# Altium schematic sheet схема 1.SchDoc
size A4; SheetNumber: 1; SheetTotal: 1
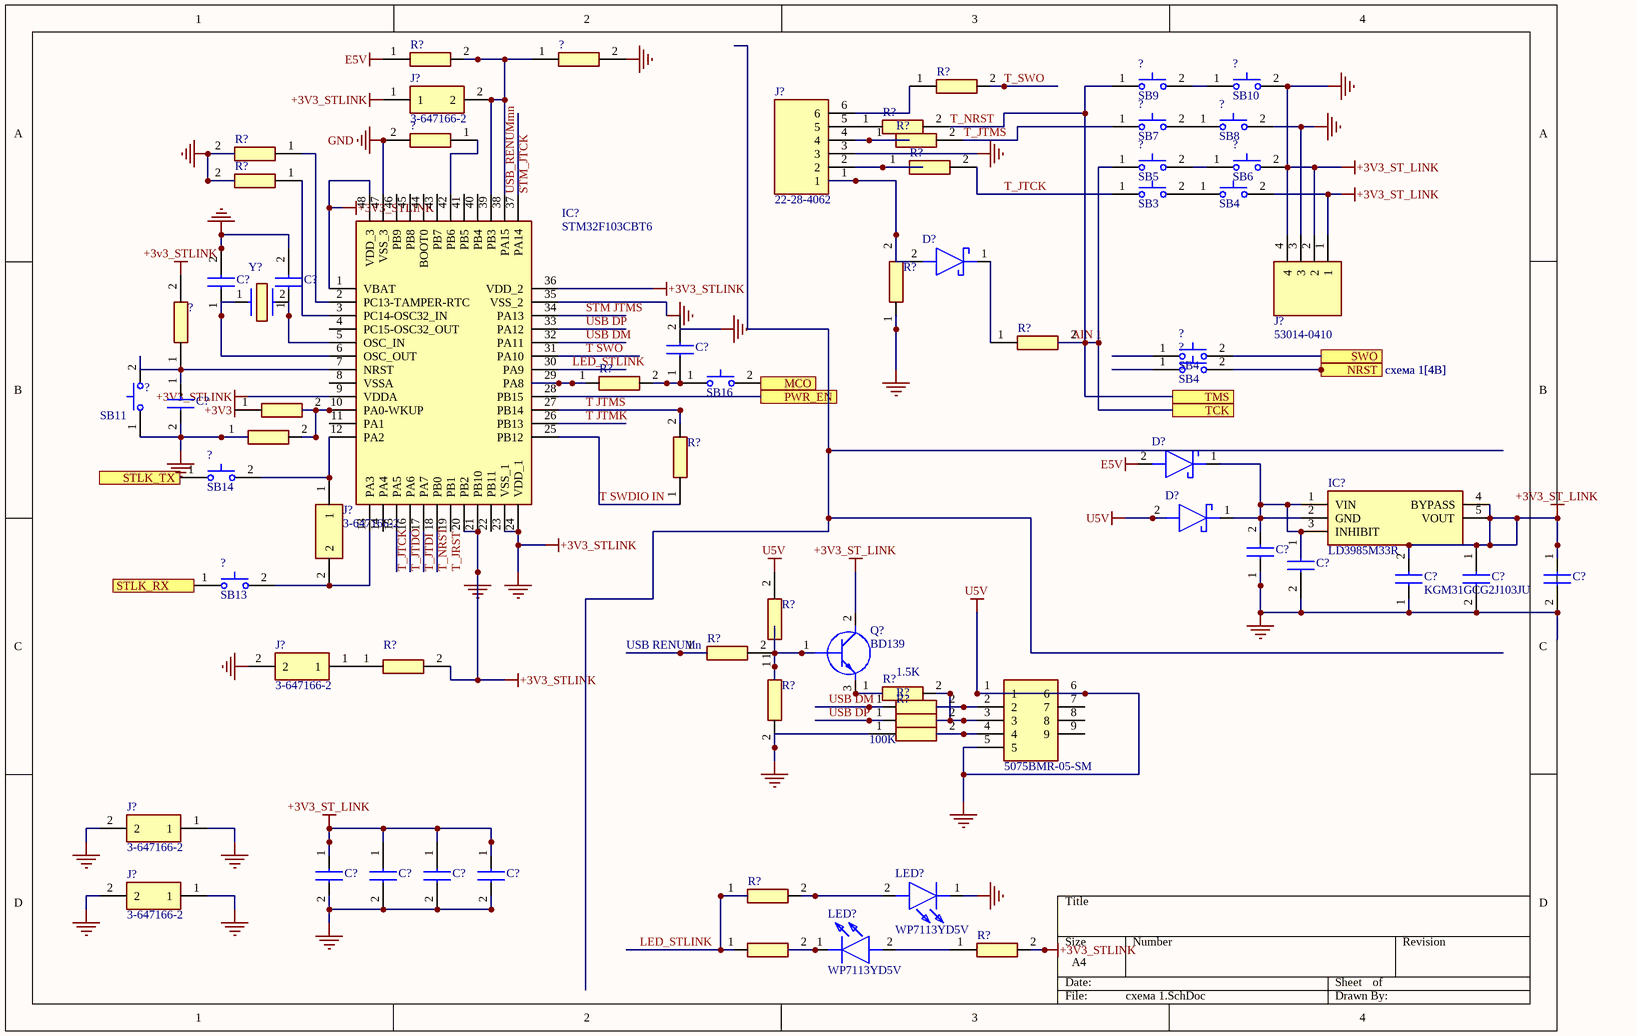
[diagram p0: схема 1.SchDoc]

## Parts
(Parts that share a designator on the sheet are numbered #1, #2 ... from top to bottom, then left to right.)
?#1  (no value)  [RESC1005X37N]
?#2  SB9  [8631CQD2]
?#3  SB10  [8631CQD2]
?#4  SB7  [8631CQD2]
?#5  SB8  [8631CQD2]
?#6  (no value)  [RESC1005X40N]
?#7  SB5  [8631CQD2]
?#8  SB6  [8631CQD2]
?#9  SB3  [8631CQD2]
?#10  SB4  [8631CQD2]
?#11  SB4  [8631CQD2]
?#12  (no value)  [RESC1005X40N]
?#13  SB4  [8631CQD2]
?#14  SB16  [8631CQD2]
?#15  (no value)  [RESC1005X37N]
?#16  SB11  [8631CQD2]
?#17  (no value)  [RESC1005X37N]
?#18  SB14  [8631CQD2]
?#19  SB13  [8631CQD2]
?#20  5075BMR-05-SM  [5075BMR05SM]
?#21  (no value)  [RESC1005X40N]
?#22  (no value)  [RESC1005X37N]
C?#1  (no value)  [C1206]
C?#2  (no value)  [C1206]
C?#3  (no value)  [CAPC1608X90N]
C?#4  (no value)  [C1206]
C?#5  (no value)  [CAPC1608X90N]
C?#6  (no value)  [CAPC1608X90N]
C?#7  (no value)  [CAPC1608X90N]
C?#8  (no value)  [MAJx16]
C?#9  KGM31GCG2J103JU  [CAPC3316X145N]
C?#10  (no value)  [CAPC1608X90N]
C?#11  (no value)  [CAPC1608X90N]
C?#12  (no value)  [CAPC1608X90N]
C?#13  (no value)  [CAPC1608X90N]
D?#1  (no value)  [SOD2513X117N]
D?#2  (no value)  [SOD2513X117N]
D?#3  (no value)  [SOD2513X117N]
IC?#1  STM32F103CBT6  [QFP50P900X900X160-48N]
IC?#2  LD3985M33R  [SOT95P280X145-5N]
J?#1  3-647166-2  [36471662]
J?#2  22-28-4062  [HDRV6W66P0X254_1X6_1524X249X838P]
J?#3  53014-0410  [SHDR4W60P0X200_1X4_1200X435X1000P]
J?#4  3-647166-2  [36471662]
J?#5  3-647166-2  [36471662]
J?#6  3-647166-2  [36471662]
J?#7  3-647166-2  [36471662]
LED?#1  WP7113YD5V  [WP7113YD5V]
LED?#2  WP7113YD5V  [WP7113YD5V]
Q?  BD139  [TO254P290X760X1320-3P]
R?#1  (no value)  [RESC3225X70N]
R?#2  (no value)  [ERA6AEB1020V]
R?#3  (no value)  [ERA6AEB1020V]
R?#4  (no value)  [ERA6AEB1020V]
R?#5  (no value)  [RESC3216X74N]
R?#6  (no value)  [ERA6AEB1020V]
R?#7  (no value)  [RESC3216X74N]
R?#8  (no value)  [RESC3216X74N]
R?#9  (no value)  [RESC1005X37N]
R?#10  (no value)  [RESC1005X37N]
R?#11  (no value)  [RESC1005X37N]
R?#12  (no value)  [RESC1005X37N]
R?#13  (no value)  [RESC2012X55N]
R?#14  (no value)  [ERA6AEB1020V]
R?#15  (no value)  [RESC3216X74N]
R?#16  1.5K  [RESC3116X65N]
R?#17  (no value)  [RESC2013X84N]
R?#18  100K  [RESC1005X40N]
R?#19  (no value)  [RESC1005X37N]
R?#20  (no value)  [RESC2013X84N]
Y?  (no value)  [ECS80125PXGMTR]

## Ports
MCO, NRST (see схема 1[4B]), PWR_EN, STLK_RX, STLK_TX, SWO, TCK, TMS

## Nets
+3V3_ST_LINK: ?#1.2 ?#3.2(N.O._2) ?#5.2(N.O._2) ?#8.2(N.O._2) ?#10.2(N.O._2) ?#12.2 ?#16.1(N.O._1) ?#17.1 ?#20.1 ?#20.5 ?#20.6 ?#21.1 C?#1.2 C?#2.2 C?#3.2 C?#5.2 C?#6.1 C?#6.2 C?#7.1 C?#7.2 C?#8.1 C?#9.1 C?#9.2 C?#10.1 C?#10.2 C?#11.1 C?#11.2 C?#12.1 C?#12.2 C?#13.1 C?#13.2 D?#3.2(A) IC?#1.1(VBAT) IC?#1.9(VDDA) IC?#1.20(PB2) IC?#1.21(PB10) IC?#1.23(VSS_1) IC?#1.24(VDD_1) IC?#1.35(VSS_2) IC?#1.36(VDD_2) IC?#1.48(VDD_3) IC?#2.4(BYPASS) IC?#2.5(VOUT) J?#1.1 J?#2.3 J?#3.1 J?#3.2 J?#3.3 J?#3.4 J?#5.2 J?#6.1 J?#6.2 J?#7.1 J?#7.2 LED?#1.1(K) Q?.2(C) R?#5.2 R?#7.2 R?#8.1 R?#13.2 R?#14.2 R?#15.2 R?#20.2  [also labelled +3V3_STLINK, U5V]
E5V: D?#2.2(A) R?#1.1
GND: ?#6.2 IC?#1.47(VSS_3)
MCO: ?#14.2(N.O._2) ; port MCO
NRST: ?#13.2(N.O._2) ; port NRST
PWR_EN: IC?#1.28(PB15) ; port PWR_EN
STLK_TX: ?#18.1(N.O._1) ; port STLK_TX
SWO: ?#11.2(N.O._2) ; port SWO
TCK: ?#2.1(N.O._1) ?#7.1(N.O._1) R?#3.2 R?#9.2 ; port TCK, port TMS
Net?#1_1: ?#1.1 IC?#1.38(PA15) IC?#1.39(PB3) J?#1.2 R?#1.2
Net?#2_2: ?#2.2(N.O._2) ?#3.1(N.O._1)
Net?#4_1: ?#4.1(N.O._1) R?#4.2
Net?#4_2: ?#4.2(N.O._2) ?#5.1(N.O._1)
Net?#6_1: ?#6.1 IC?#1.42(PB6)
Net?#7_2: ?#7.2(N.O._2) ?#8.1(N.O._1)
Net?#9_1: ?#9.1(N.O._1) R?#6.2
Net?#9_2: ?#9.2(N.O._2) ?#10.1(N.O._1)
Net?#12_1: ?#12.1 ?#16.2(N.O._2) C?#3.1 IC?#1.7(NRST)
Net?#14_1: ?#14.1(N.O._1) C?#4.1 R?#10.2
Net?#15_2: ?#15.2 ?#17.2 IC?#1.10(PA0-WKUP)
Net?#18_2: ?#18.2(N.O._2) IC?#1.12(PA2) J?#4.1
Net?#19_2: ?#19.2(N.O._2) IC?#1.13(PA3) J?#4.2
Net?#20_2: ?#20.2 R?#17.2
Net?#20_3: ?#20.3 R?#16.2 R?#18.2
Net?#20_4: ?#20.4 ?#21.2
Net?#22_1: ?#22.1 R?#19.1
Net?#22_2: ?#22.2 LED?#2.1(K)
NetC?#1_1: C?#1.1 IC?#1.6(OSC_OUT) Y?.1
NetC?#2_1: C?#2.1 IC?#1.5(OSC_IN) Y?.2
NetC?#5_1: C?#5.1 C?#8.2 D?#2.1(K) D?#3.1(K) IC?#2.1(VIN) IC?#2.2(GND) IC?#2.3(INHIBIT)
NetD?#1_1: D?#1.1(K) R?#9.1
NetD?#1_2: D?#1.2(A) J?#2.1 R?#8.2
NetIC?#1_2: IC?#1.2(PC13-TAMPER-RTC) R?#5.1
NetIC?#1_3: IC?#1.3(PC14-OSC32_IN) R?#7.1
NetIC?#1_25: IC?#1.25(PB12) R?#11.1
NetIC?#1_27: IC?#1.27(PB14) R?#11.2
NetIC?#1_29: IC?#1.29(PA8) R?#10.1
NetJ?#2_2: J?#2.2 R?#6.1
NetJ?#2_4: J?#2.4 R?#4.1
NetJ?#2_5: J?#2.5 R?#3.1
NetJ?#2_6: J?#2.6 R?#2.1
NetJ?#5_1: J?#5.1 R?#14.1
NetLED?#1_2: LED?#1.2(A) R?#19.2
NetLED?#2_2: LED?#2.2(A) R?#20.1
NetQ?_1: Q?.1(B) R?#12.2 R?#13.1 R?#15.1
NetQ?_3: Q?.3(E) R?#16.1

Not connected (* = marked no-connect by the designer): ?#11 1(N.O._1); ?#13 1(N.O._1); ?#15 1; ?#19 1(N.O._1); ?#20 7 8 9; C?#4 2; IC?#1 4(PC15-OSC32_OUT) 8(VSSA) 11(PA1) 14(PA4) 15(PA5) 16(PA6) 17(PA7) 18(PB0) 19(PB1) 22(PB11) 26(PB13) 30(PA9) 31(PA10) 32(PA11) 33(PA12) 34(PA13) 37(PA14) 40(PB4) 41(PB5) 43(PB7) 44(BOOT0) 45(PB8) 46(PB9); R?#2 2; R?#12 1; R?#17 1; R?#18 1

## Notes on the sheet
- (near R?#2) T_SWO
- (near R?#4) T_NRST
- (near R?#4) T_JTMS
- (near IC?#1) USB_RENUMmn
- (near IC?#1) STM_JTCK
- T_JTCK
- STM JTMS
- (near R?#10) LED_STLINK
- USB DP
- USB DM
- (near R?#10) T SWO
- (near R?#9) AIN 1
- (near R?#10) T JTMS
- (near R?#10) T JTMK
- (near R?#11) T SWDIO IN
- (near IC?#1) T_JTCK
- (near IC?#1) T_JTDO
- (near IC?#1) T_JTDI
- (near IC?#1) T_NRST
- (near IC?#1) T_JRST
- (near R?#12) USB RENUMn
- LED_STLINK
- Labels drawn without touching a wire or pin: +3V3

## Library data of the parts
?#1 ?#15 ?#17 = MCS04020D4701BE000: Resistor; Manufacturer_Name: Vishay; Datasheet Link: http://www.vishay.com/docs/28705/mcx0x0xpro.pdf; Height: 0.37mm; Manufacturer_Part_Number: MCS04020D4701BE000; Mouser Part Number: 594-MCS04020D4701BE0; Mouser Price/Stock: https://www.mouser.co.uk/ProductDetail/Vishay-Beyschlag/MCS04020D4701BE000?qs=ft9OtscSA3%252BR0DpF5QqL2Q%3D%3D
?#2-?#5 ?#7-?#11 ?#13 ?#14 ?#16 ?#18 ?#19 = 8631CQD2: Switch (2-Pin Push); Manufacturer_Name: C & K COMPONENTS; Datasheet Link: https://www.ckswitches.com/media/1396/8600.pdf; Height: 13.93mm; Manufacturer_Part_Number: 8631CQD2; Mouser Part Number: 611-8631-261; Mouser Price/Stock: https://www.mouser.co.uk/ProductDetail/CK/8631CQD2?qs=ktcBc77oICXe9iPhfEwnkA%3D%3D
?#6 ?#12 ?#21 R?#18 = SFR01MZPF1003: Resistor; Manufacturer_Name: ROHM Semiconductor; Datasheet Link: https://fscdn.rohm.com/en/products/databook/datasheet/passive/resistor/chip_resistor/sfr-e.pdf; Height: 0.4mm; Manufacturer_Part_Number: SFR01MZPF1003; Mouser Part Number: 755-SFR01MZPF1003; Mouser Price/Stock: https://www.mouser.co.uk/ProductDetail/ROHM-Semiconductor/SFR01MZPF1003?qs=Mv7BduZupUj2RFL5gMaKTg%3D%3D
?#20 = 5075BMR-05-SM: Connector; Manufacturer_Name: NELTRON; Datasheet Link: http://www.ibselectronics.com/ibsstore/datasheet/5075BMR-05-SM-CR.pdf; Height: 4mm; Manufacturer_Part_Number: 5075BMR-05-SM
?#22 R?#9-R?#12 R?#19 = MCS04020C1000FE000: Resistor; Manufacturer_Name: Vishay; Datasheet Link: http://www.vishay.com/docs/28705/mcx0x0xpro.pdf; Height: 0.37mm; Manufacturer_Part_Number: MCS04020C1000FE000; Mouser Part Number: 594-MCS04020C1000FE0; Mouser Price/Stock: https://www.mouser.co.uk/ProductDetail/Vishay-Beyschlag/MCS04020C1000FE000?qs=7ZE6F4QMOBYkwvQlfbkT8w%3D%3D; Arrow Part Number: MCS04020C1000FE000; Arrow Price/Stock: https://www.arrow.com/en/products/mcs04020c1000fe000/vishay
C?#1 C?#2 C?#4 = C1206C200KCGACTU: Capacitor; Manufacturer_Name: KEMET; Datasheet Link: https://content.kemet.com/datasheets/KEM_C1009_C0G_HV_SMD.pdf; Manufacturer_Part_Number: C1206C200KCGACTU
C?#3 C?#5-C?#7 C?#10-C?#13 = KAM15AR71H104KM: Capacitor; Manufacturer_Name: Kyocera AVX; Datasheet Link: https://datasheets.kyocera-avx.com/AutoMLCCKAM.pdf; Height: 0.9mm; Manufacturer_Part_Number: KAM15AR71H104KM; Mouser Part Number: 581-KAM15AR71H104KM; Mouser Price/Stock: https://www.mouser.co.uk/ProductDetail/KYOCERA-AVX/KAM15AR71H104KM?qs=Jm2GQyTW%2FbgzS5FHJWrFzQ%3D%3D; Arrow Part Number: KAM15AR71H104KM; Arrow Price/Stock: https://www.arrow.com/en/products/kam15ar71h104km/avx?region=nac
C?#8 = MAJCT168BB7105KTEA01: Capacitor; Manufacturer_Name: TAIYO YUDEN; Datasheet Link: https://ds.yuden.co.jp/TYCOMPAS/or/detail?pn=MAJCT168BB7105KTEA01; Height: 0.8mm; Manufacturer_Part_Number: MAJCT168BB7105KTEA01
C?#9 = KGM31GCG2J103JU: Capacitor; Manufacturer_Name: Kyocera AVX; Datasheet Link: https://datasheets.kyocera-avx.com/HVKGM.pdf; Height: 1.45mm; Manufacturer_Part_Number: KGM31GCG2J103JU; Mouser Part Number: 581-KGM31GCG2J103JU; Mouser Price/Stock: https://www.mouser.co.uk/ProductDetail/KYOCERA-AVX/KGM31GCG2J103JU?qs=63Lh8XYXgjt6ivbLeGkCxg%3D%3D
D?#1-D?#3 = BAT60JFILM: Schottky Diode; Manufacturer_Name: STMicroelectronics; Datasheet Link: https://www.mouser.jp/datasheet/2/389/cd00001944-1795661.pdf; Height: 1.17mm; Manufacturer_Part_Number: BAT60JFILM; Mouser Part Number: 511-BAT60JFILM; Mouser Price/Stock: https://www.mouser.co.uk/ProductDetail/STMicroelectronics/BAT60JFILM?qs=GnFZssByvVVVnMaukcyLZg%3D%3D; Arrow Part Number: BAT60JFILM; Arrow Price/Stock: https://www.arrow.com/en/products/bat60jfilm/stmicroelectronics?region=nac
IC?#1 = STM32F103CBT6: Integrated Circuit; Manufacturer_Name: STMicroelectronics; Datasheet Link: http://www.st.com/st-web-ui/static/active/en/resource/technical/document/datasheet/CD00161566.pdf; Height: 1.6mm; Manufacturer_Part_Number: STM32F103CBT6; Mouser Part Number: 511-STM32F103CBT6; Mouser Price/Stock: https://www.mouser.co.uk/ProductDetail/STMicroelectronics/STM32F103CBT6?qs=WxFF5lh7QM3goh6GV5Ogig%3D%3D; Arrow Part Number: STM32F103CBT6; Arrow Price/Stock: https://www.arrow.com/en/products/stm32f103cbt6/stmicroelectronics?region=europe
IC?#2 = LD3985M33R: Integrated Circuit; Manufacturer_Name: STMicroelectronics; Datasheet Link: http://www.st.com/st-web-ui/static/active/en/resource/technical/document/datasheet/CD00003395.pdf; Height: 1.45mm; Manufacturer_Part_Number: LD3985M33R; Mouser Part Number: 511-LD3985M33R; Mouser Price/Stock: https://www.mouser.co.uk/ProductDetail/STMicroelectronics/LD3985M33R?qs=22WmWNTp1rrPOccVv4HZ7A%3D%3D; Arrow Part Number: LD3985M33R; Arrow Price/Stock: https://www.arrow.com/en/products/ld3985m33r/stmicroelectronics?region=europe
J?#1 J?#4-J?#7 = 3-647166-2: Connector; Manufacturer_Name: TE Connectivity; Datasheet Link: https://www.te.com/commerce/DocumentDelivery/DDEController?Action=showdoc&DocId=Customer+Drawing%7F647166%7FR1%7Fpdf%7FEnglish%7FENG_CD_647166_R1.pdf%7F3-647166-2; Height: 10.66mm; Manufacturer_Part_Number: 3-647166-2; Mouser Part Number: 571-3-647166-2; Mouser Price/Stock: https://www.mouser.co.uk/ProductDetail/TE-Connectivity/3-647166-2?qs=xsTFCgGnzbJU1qz6Np9kzA%3D%3D; Arrow Part Number: 3-647166-2; Arrow Price/Stock: https://www.arrow.com/en/products/3-647166-2/te-connectivity?region=nac
J?#2 = 22-28-4062: Connector; Manufacturer_Name: Molex; Datasheet Link: https://datasheet.datasheetarchive.com/originals/distributors/SFDatasheet-1/sf-00031037.pdf; Height: 8.38mm; Manufacturer_Part_Number: 22-28-4062; Mouser Part Number: 538-22-28-4062; Mouser Price/Stock: https://www.mouser.com/Search/Refine.aspx?Keyword=538-22-28-4062
J?#3 = 53014-0410: Connector; Manufacturer_Name: Molex; Datasheet Link: https://www.molex.com/pdm_docs/sd/530140410_sd.pdf; Height: 10mm; Manufacturer_Part_Number: 53014-0410; Mouser Part Number: 538-53014-0410; Mouser Price/Stock: https://www.mouser.co.uk/ProductDetail/Molex/53014-0410?qs=TLs3Kb%252BkMqKk8s1WRHwRGw%3D%3D
LED?#1 LED?#2 = WP7113YD5V: LED; Manufacturer_Name: Kingbright; Datasheet Link: https://www.kingbrightusa.com/images/catalog/SPEC/WP7113YD5V.pdf; Height: 8.85mm; Manufacturer_Part_Number: WP7113YD5V; Mouser Part Number: 604-WP7113YD5V; Mouser Price/Stock: https://www.mouser.co.uk/ProductDetail/Kingbright/WP7113YD5V/?qs=58z0TXQGVSQxAnYThDK13Q%3D%3D; Arrow Part Number: WP7113YD5V; Arrow Price/Stock: https://www.arrow.com/en/products/wp7113yd5v/kingbright
Q? = BD139: Transistor BJT NPN; Manufacturer_Name: STMicroelectronics; Datasheet Link: http://www.st.com/web/en/resource/technical/document/datasheet/CD00001225.pdf; Height: 2.9mm; Manufacturer_Part_Number: BD139; Mouser Part Number: 511-BD139; Mouser Price/Stock: https://www.mouser.co.uk/ProductDetail/STMicroelectronics/BD139?qs=ljbEvF4DwOPW%2FLxHSWYMMA%3D%3D; Arrow Part Number: BD139; Arrow Price/Stock: https://www.arrow.com/en/products/bd139/stmicroelectronics?region=europe
R?#1 = CRCW12102K70FKEAHP: Resistor; Manufacturer_Name: Vishay; Datasheet Link: http://componentsearchengine.com/Datasheets/1/CRCW12102K70FKEAHP.pdf; Height: 0.7mm; Manufacturer_Part_Number: CRCW12102K70FKEAHP; Mouser Part Number: 71-CRCW12102K70FKEAH; Mouser Price/Stock: https://www.mouser.co.uk/ProductDetail/Vishay-Dale/CRCW12102K70FKEAHP?qs=OAzHGkhREL0m0%252BU1n6AaAg%3D%3D
R?#2-R?#4 R?#6 R?#14 = ERA-6AHD220V: Resistor; Manufacturer_Name: Panasonic; Datasheet Link: https://industrial.panasonic.com/cdbs/www-data/pdf/RDM0000/AOA0000C307.pdf; Height: 0.6mm; Manufacturer_Part_Number: ERA-6AHD220V; Mouser Part Number: 667-ERA-6AHD220V; Mouser Price/Stock: https://www.mouser.co.uk/ProductDetail/Panasonic/ERA-6AHD220V/?qs=MNPzkKEzRtQTWqg2JSKn2A%3D%3D
R?#5 R?#7 R?#8 R?#15 = CRMV1206AF10K0FKE5: Resistor; Manufacturer_Name: Vishay; Datasheet Link: https://www.vishay.com/docs/68037/crmv.pdf; Height: 0.74mm; Manufacturer_Part_Number: CRMV1206AF10K0FKE5; Mouser Part Number: 71-RMV1206AF10K0FKE5; Mouser Price/Stock: https://www.mouser.co.uk/ProductDetail/Vishay-Techno/CRMV1206AF10K0FKE5?qs=l8RvIzyJx4lLA%2F4RSSc%2F9A%3D%3D
R?#13 = TNPW080536K0BEEA: Resistor; Manufacturer_Name: Vishay; Datasheet Link: https://www.vishay.com/docs/31006/tnpw.pdf; Height: 0.55mm; Manufacturer_Part_Number: TNPW080536K0BEEA
R?#16 = CRCW12061K50FKEAHP: Resistor; Manufacturer_Name: Vishay; Datasheet Link: http://componentsearchengine.com/Datasheets/1/CRCW12061K50FKEAHP.pdf; Height: 0.65mm; Manufacturer_Part_Number: CRCW12061K50FKEAHP; Mouser Part Number: 71-CRCW12061K50FKEAH; Mouser Price/Stock: https://www.mouser.co.uk/ProductDetail/Vishay-Dale/CRCW12061K50FKEAHP?qs=k2%2FDWSARqgEwHXAQbL4aEg%3D%3D; Arrow Part Number: CRCW12061K50FKEAHP; Arrow Price/Stock: https://www.arrow.com/en/products/crcw12061k50fkeahp/vishay?region=nac
R?#17 R?#20 = WSL080500000ZEA9: Resistor; Manufacturer_Name: Vishay; Datasheet Link: https://ad.componentsearchengine.com/Datasheets/2/WSL080500000ZEA9.pdf; Height: 0.838mm; Manufacturer_Part_Number: WSL080500000ZEA9; Mouser Part Number: 71-WSL080500000ZEA9; Mouser Price/Stock: https://www.mouser.co.uk/ProductDetail/Vishay-Dale/WSL080500000ZEA9?qs=f1l5vAGoKgsImKS87N8TmQ%3D%3D; Arrow Part Number: WSL080500000ZEA9; Arrow Price/Stock: https://www.arrow.com/en/products/wsl080500000zea9/vishay?region=nac
Y? = ECS-80-12-5PX-GM-TR: Crystal or Oscillator; Manufacturer_Name: ECS; Datasheet Link: https://ecsxtal.com/store/pdf/csm-7x.pdf; Height: 4.3mm; Manufacturer_Part_Number: ECS-80-12-5PX-GM-TR; Mouser Part Number: 520-80-12-5PX-GM-TR; Mouser Price/Stock: https://www.mouser.co.uk/ProductDetail/ECS/ECS-80-12-5PX-GM-TR?qs=amGC7iS6iy%252BwzUdIY7WpOA%3D%3D